# EAGLE design Arduino Shield v7.1.3 (EAGLE 8.5.1)
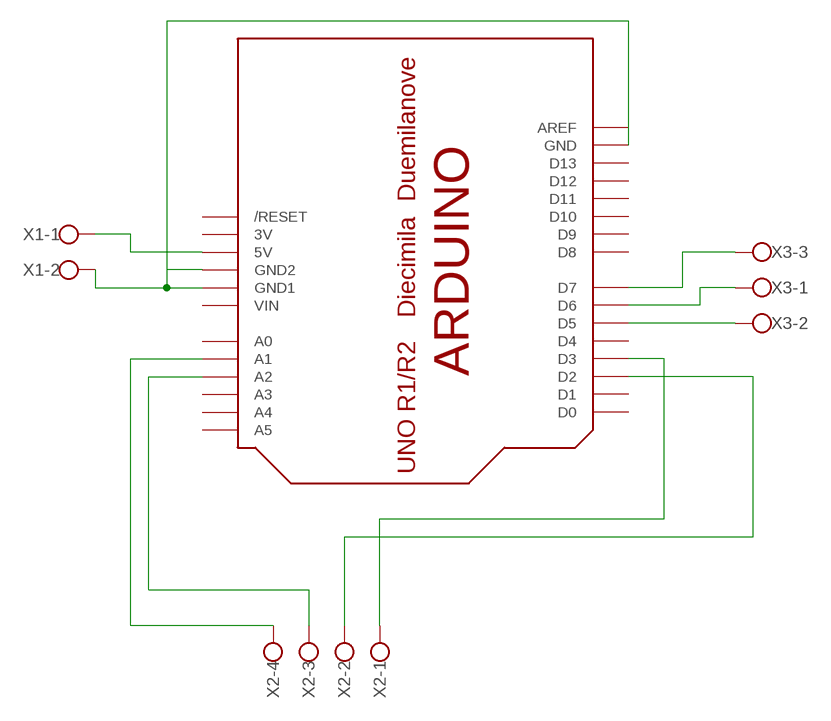
[diagram p0: schematic, sheet 1]

## Parts
U$1  ARDUINOUNO  [ARDUINO]
X1  W237-102  [W237-102]
X2  W237-4  [W237-4]
X3  W237-103  [W237-103]

## Nets
GND: U$1.GND U$1.GND1 U$1.GND2 X1.2
N$1: U$1.A1 X2.4
N$3: U$1.A2 X2.3
N$4: U$1.D3 X2.1
N$5: U$1.D5 X3.2
N$6: U$1.D6 X3.1
N$7: U$1.D7 X3.3
N$8: U$1.D2 X2.2
N$9: U$1.5V X1.1
Unconnected: U$1.A0 U$1.A3 U$1.A4 U$1.A5 U$1.AREF U$1.D0 U$1.D1 U$1.D4 U$1.D8 U$1.D9 U$1.D10 U$1.D11 U$1.D12 U$1.D13 U$1.RESET(/RESET)

## Power pins joined to a net without a drawn wire
3V: U$1.3V
VIN: U$1.VIN

## Library data of the parts
U$1 = adafruit:ARDUINO: Arduino Diecimila/Duemilanove Make a shield with ease, this package has all the named pins as well as the two mounting drill holes and an outline of the USB and DC power connector. The outline is on the DIMENSION layer, so if your board house uses it they will cut the outline to match. http://www.ladyada.net/library/pcb/eaglelibrary.html
X1 = con-wago-500:W237-102: WAGO SCREW CLAMP; MPN: 237-102; OC_FARNELL: unknown; OC_NEWARK: 70K9898
X2 = con-wago-500:W237-4: WAGO SCREW CLAMP; OC_FARNELL: unknown; OC_NEWARK: unknown
X3 = con-wago-500:W237-103: WAGO SCREW CLAMP; MPN: 237-103; OC_FARNELL: unknown; OC_NEWARK: 18M7116

## Board
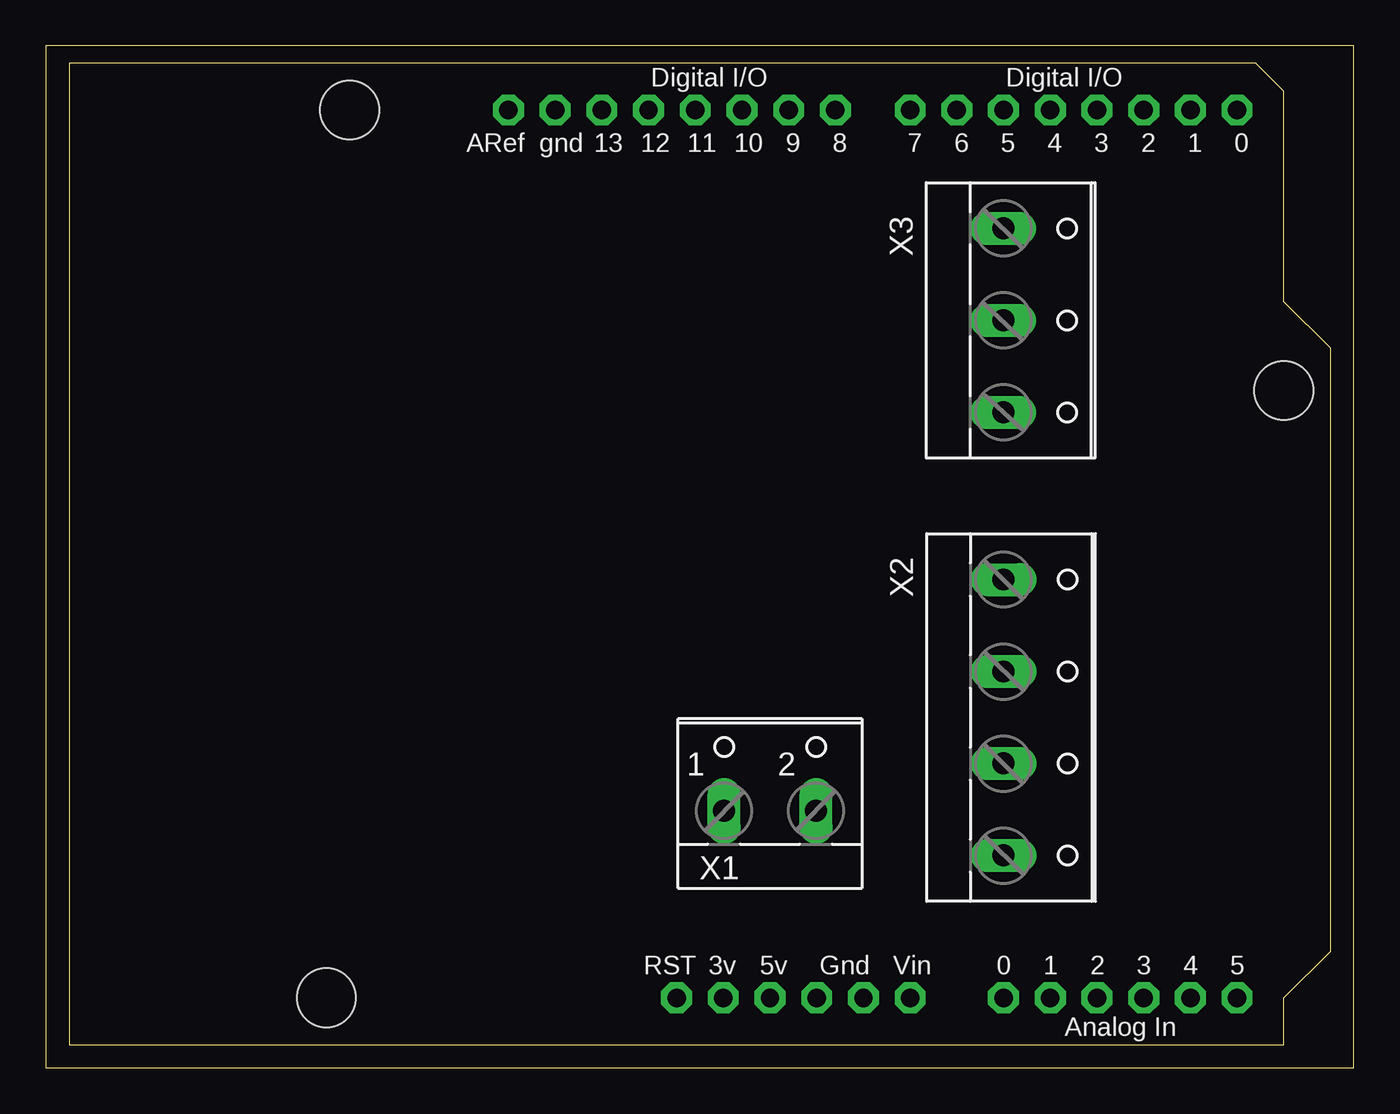
[diagram p1: board, top side]
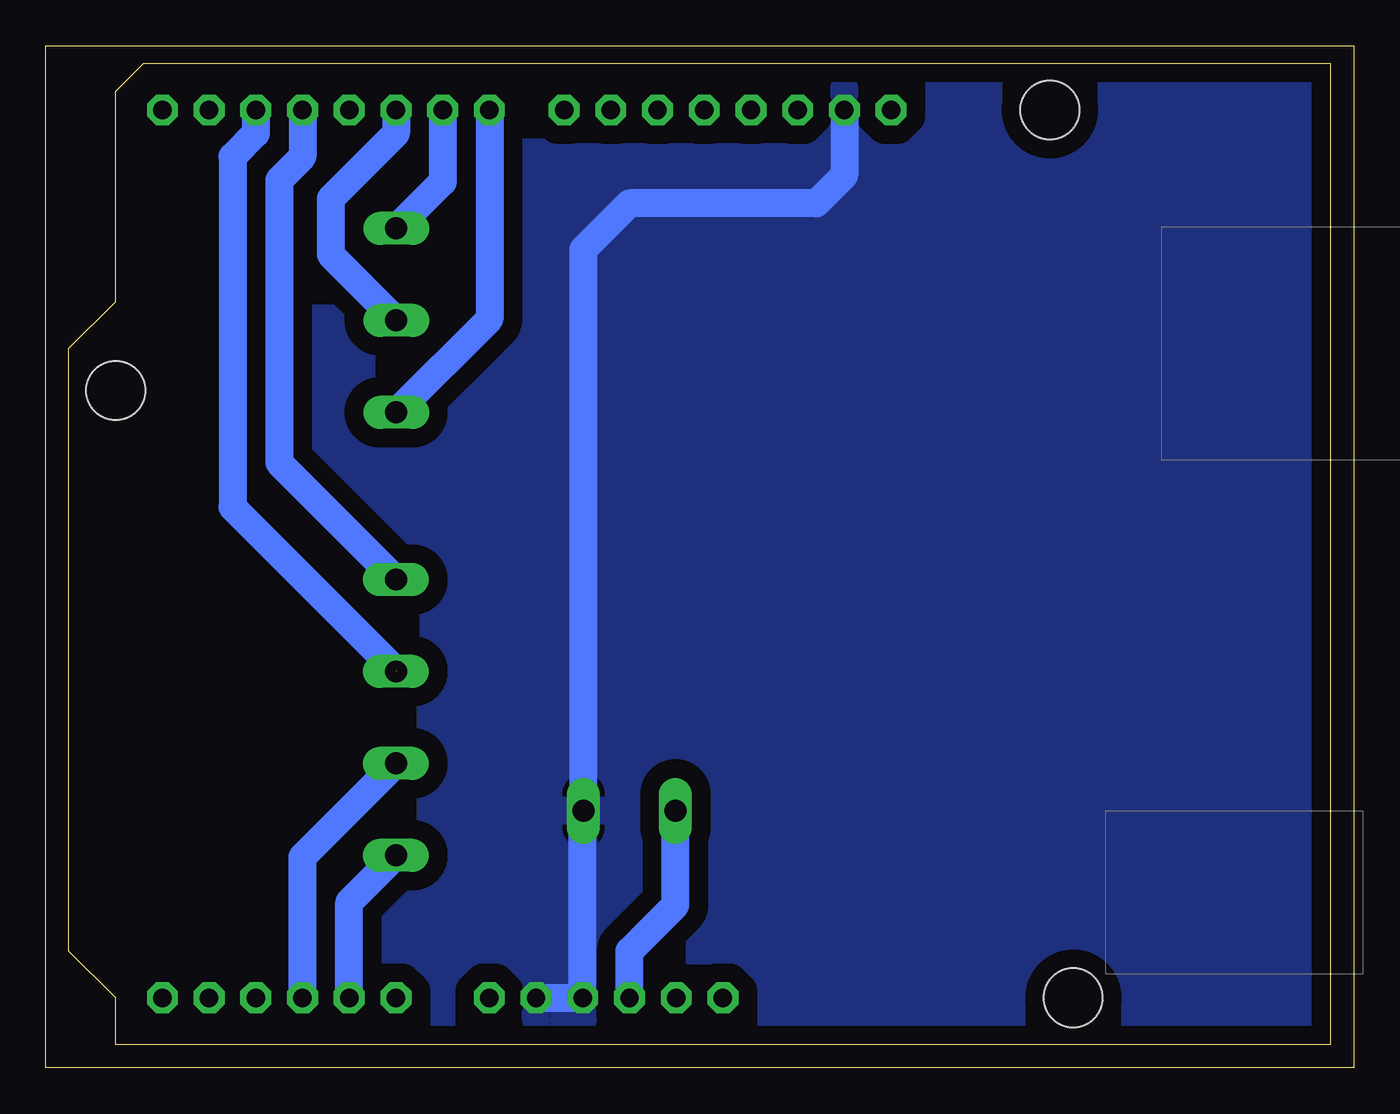
[diagram p2: board, bottom side, seen from below]

Size 71.1 x 55.55 mm. Coordinates in mm from the lower left corner, seen from the top.
Outline: 0,0 71.1,0 71.1,55.55 0,55.55 0,0
Copper layers (1*16): Top 0.035mm / dielectric 1.5mm / Bottom 0.035mm
Design rules "default *": minimum track width 6mil, minimum drill 0.35mm, track to track 40mil, track to pad 40mil, pad to pad 6mil, via to via 6mil, smd to smd 6mil, copper to edge 40mil, drill to drill 6mil, minimum pad ring 10mil, minimum via ring 8mil, stop-mask expansion 4mil, vias tented up to drill 0mil, thermal gap 10mil

### Footprints (pad centres in the part's own frame; a part is rotated, then mirrored left to right if it is on the bottom)
ARDUINO = drill 1 pad 1.676 octagon: 3V 35.56,2.54; 5V 38.1,2.54; A0 50.8,2.54; A1 53.34,2.54; A2 55.88,2.54; A3 58.42,2.54; A4 60.96,2.54; A5 63.5,2.54; AREF 23.876,50.8; D0 63.5,50.8; D1 60.96,50.8; D2 58.42,50.8; D3 55.88,50.8; D4 53.34,50.8; D5 50.8,50.8; D6 48.26,50.8; D7 45.72,50.8; D8 41.656,50.8; D9 39.116,50.8; D10 36.576,50.8; D11 34.036,50.8; D12 31.496,50.8; D13 28.956,50.8; GND 26.416,50.8; GND1 43.18,2.54; GND2 40.64,2.54; RESET 33.02,2.54; VIN 45.72,2.54 | hole 3.2: 15.24,50.8; 66.04,35.56; 13.97,2.54
W237-102 = drill 1.194 long: 1 -2.5,-1.27; 2 2.5,-1.27
W237-4 = drill 1.194 long: 1 -7.5,-1.27; 2 -2.5,-1.27; 3 2.5,-1.27; 4 7.5,-1.27
W237-103 = drill 1.194 long: 1 -5,-1.29; 2 0,-1.29; 3 5,-1.29

### Placement (x,y rotation side)
U$1  1.27,1.27 0 top
X1  39.37,15.24 0 top
X2  53.34,19.05 270 top
X3  53.34,40.64 270 top

### Tracks (layer width: path | path; a pad name or v marks a point on that pad's centre or on a via)
GND
  Bottom 1.524: U$1.GND1 U$1.GND2 41.91,13.93 X1.2 41.87,44.49 39.37,46.99 29.21,46.99 27.69,48.51 U$1.GND
  pour Bottom: 1.27,54.61 71.12,54.61 71.12,0 0,0 0,53.34
N$1
  Bottom 1.524: U$1.A1 54.61,9.01 X2.4
N$3
  Bottom 1.524: U$1.A2 57.15,11.47 X2.3
N$4
  Bottom 1.524: U$1.D3 57.15,49.53 58.42,48.26 58.42,32.9 X2.1
N$5
  Bottom 1.524: U$1.D5 52.07,50.8 55.62,47.25 55.62,44.21 X3.2
N$6
  Bottom 1.524: U$1.D6 49.53,48.16 X3.1
N$7
  Bottom 1.524: U$1.D7 46.99,40.7 X3.3
N$8  (1 unrouted)
  Bottom 1.524: U$1.D2 59.69,50.8 60.96,49.53 60.96,30.48 52.07,21.59
N$9
  Bottom 1.524: U$1.5V 39.37,6.35 36.87,8.85 X1.1